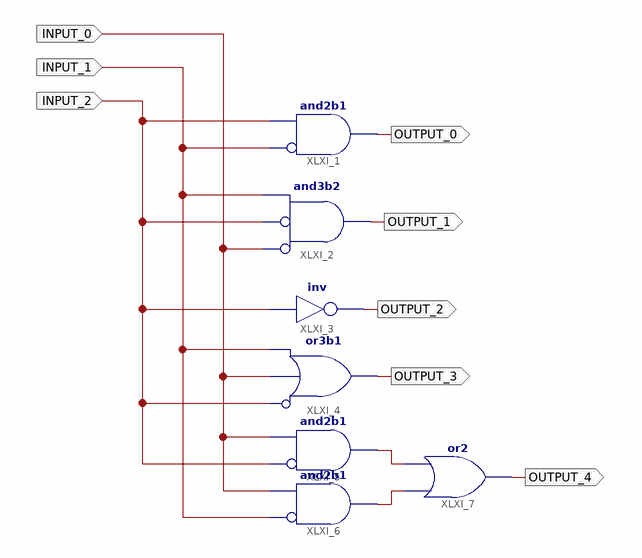
[diagram p0: schematic sheet 1]
// Xilinx ISE schematic SCHEME.sch (spartan3a) as structural Verilog: 7 symbols, 8 ports
module SCHEME (
  input  INPUT_0,
  input  INPUT_1,
  input  INPUT_2,
  output OUTPUT_0,
  output OUTPUT_1,
  output OUTPUT_2,
  output OUTPUT_3,
  output OUTPUT_4
);

  wire XLXN_5, XLXN_6;

  and XLXI_1 (OUTPUT_0, ~INPUT_1, INPUT_2);  // and2b1
  and XLXI_2 (OUTPUT_1, ~INPUT_0, ~INPUT_2, INPUT_1);  // and3b2
  not XLXI_3 (OUTPUT_2, INPUT_2);
  or XLXI_4 (OUTPUT_3, ~INPUT_2, INPUT_0, INPUT_1);  // or3b1
  and XLXI_5 (XLXN_5, ~INPUT_2, INPUT_0);  // and2b1
  and XLXI_6 (XLXN_6, ~INPUT_1, INPUT_0);  // and2b1
  or XLXI_7 (OUTPUT_4, XLXN_6, XLXN_5);
endmodule
